# EAGLE design DAU_Kupplung_1_phasig_V1_10 (EAGLE 6.1)
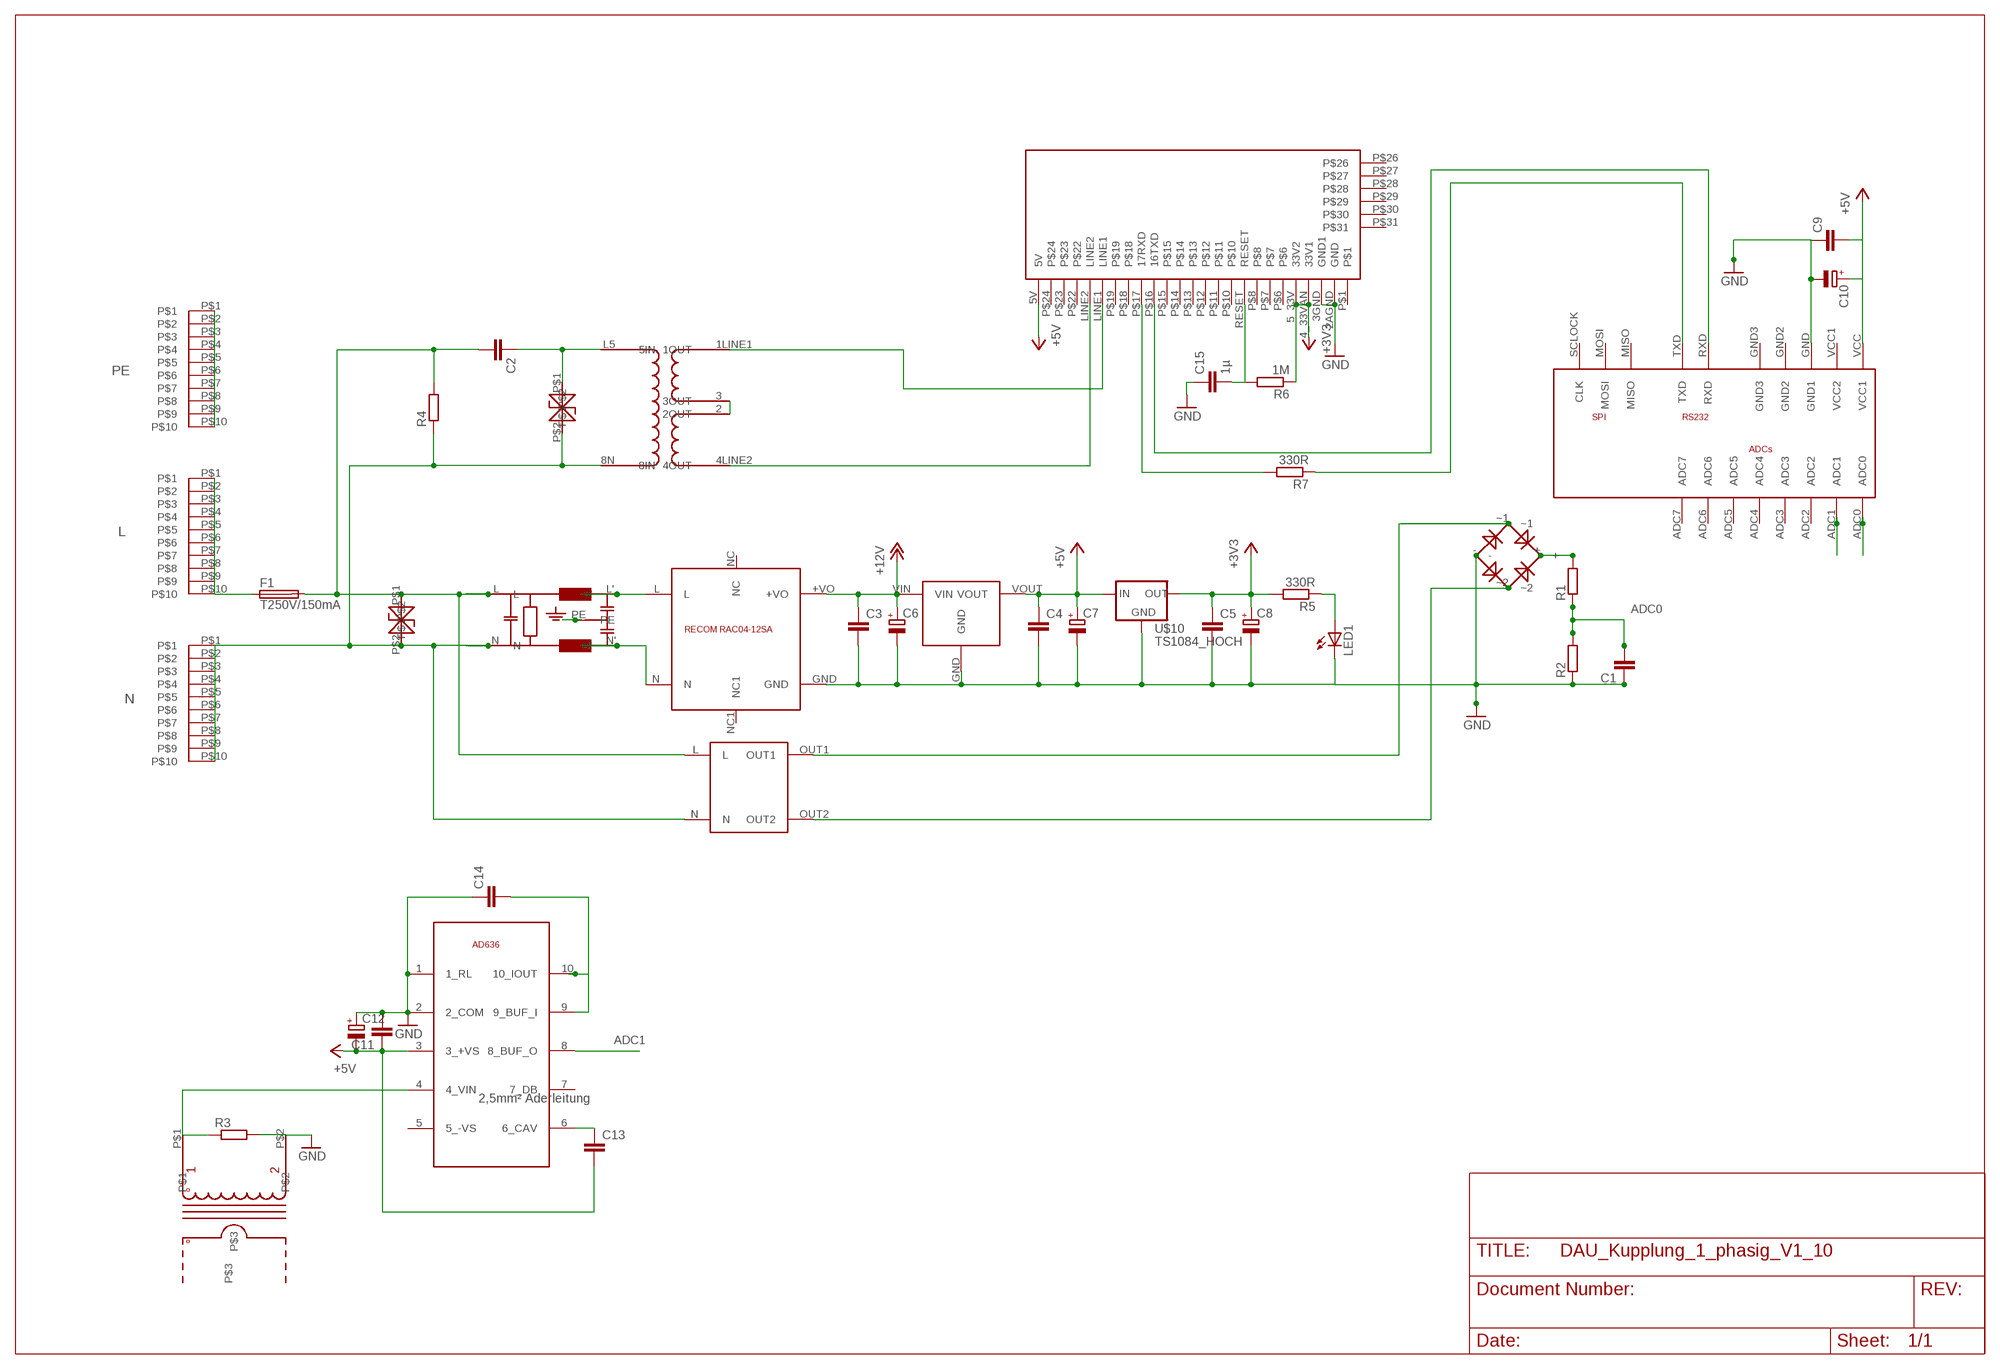
[diagram p0: schematic, sheet 1]

## Parts
C1  C2,5-3  [C2.5-3]
C2  C-EU225-087X268  [C225-087X268]
C3  C-EUC0805  [C0805]
C4  C-EUC0805  [C0805]
C5  C-EUC0805  [C0805]
C6  CPOL-EUE2.5-6  [E2,5-6]
C7  CPOL-EUE2.5-6  [E2,5-6]
C8  CPOL-EUE2.5-6  [E2,5-6]
C9  C-EUC0805  [C0805]
C10  CPOL-EUE2,5-6E  [E2,5-6E]
C11  C-EUC0805  [C0805]
C12  CPOL-EUE2,5-6E  [E2,5-6E]
C13  C-EUC0805  [C0805]
C14  C-EUC0805  [C0805]
C15  1µ  C-EUC0805  [C0805]
F1  T250V/150mA  TR5  [TR5]
L  PRINT_CONNECTOR  [FASTON_DOUBLE]
LED1  LEDSQR2X5  [LED2X5]
N  PRINT_CONNECTOR  [FASTON_DOUBLE]
PE  PRINT_CONNECTOR  [FASTON_DOUBLE]
R1  R-EU_0204/7  [0204/7]
R2  R-EU_0204/7  [0204/7]
R3  R-EU_0204/7  [0204/7]
R4  R-EU_0204/7  [0204/7]
R5  330R  R-EU_0204/7  [0204/7]
R6  1M  R-EU_0204/7  [0204/7]
R7  330R  R-EU_0204/7  [0204/7]
U$1  RECOM_RAC04_12SA  [RAC04_12SA]
U$2  SICHERHEITSTRAFO  [TRAFO_0,35VA]
U$3  ADUC831_MINIMUM  [ADUC_MINIMUM]
U$4  IT800  [IT800]
U$5  PLC_UEBERTRAGER_V2  [PLC-UEBERTRAGER_V2]
U$6  AC1010  [AC1010]
U$7  AD636  [TO100_10PIN]
U$8  RECTIFIER  [RECTIFIER]
U$9  TSV  [TSV]
U$10  TS1084_HOCH  [TS1084_HOCH]
U$11  RECOM_785_05  [RECOM785X]
U$12  TSV  [TSV]
U$13  NETZFILTER_05_A  [NETZFILTER]

## Nets
+3V3: C5.1 C8.+ R5.2 R6.1 U$4.4_33VAN(33V1) U$4.5_33V(33V2) U$10.OUT
+5V: C4.1 C7.+ C9.2 C10.+ C11.1 C12.- C13.2 U$3.VCC(VCC1) U$4.5V U$7.3(3_+VS) U$10.IN U$11.VOUT
+12V: C3.1 C6.+ U$1.+VO U$11.VIN
ADC0: C1.2 R1.1 R2.2 U$3.ADC0
ADC1: U$3.ADC1 U$7.8(8_BUF_O)
GND: C1.1 C3.2 C4.2 C5.2 C6.- C7.- C8.- C9.1 C10.- C11.2 C12.+ C14.1 C15.1 LED1.K(C) R2.1 R3.2 U$1.GND U$3.GND(GND1) U$4.2AGND(GND) U$4.3GND(GND1) U$6.P$2 U$7.1(1_RL) U$7.2(2_COM) U$8.- U$10.GND U$11.GND
N$1: U$5.2(2OUT) U$5.3(3OUT)
N$3: R7.2 U$4.P$17(17RXD)
N$4: U$2.OUT1 U$8.~1
N$5: U$4.LINE1 U$5.1LINE1(1OUT)
N$6: F1.1 L.P$1 L.P$2 L.P$3 L.P$4 L.P$5 L.P$6 L.P$7 L.P$8 L.P$9 L.P$10
N$7: R1.2 U$8.+
N$8: R3.1 U$6.P$1 U$7.4(4_VIN)
N$9: U$2.OUT2 U$8.~2
N$11: C2.1 U$5.L5(5IN) U$12.P$1
N$12: C2.2 F1.2 R4.2 U$2.L U$9.P$1 U$13.L
N$13: U$4.LINE2 U$5.4LINE2(4OUT)
N$14: R7.1 U$3.TXD
N$15: U$3.RXD U$4.P$16(16TXD)
N$16: C14.2 U$7.9(9_BUF_I) U$7.10(10_IOUT)
N$17: C13.1 U$7.6(6_CAV)
N$18: N.P$1 N.P$2 N.P$3 N.P$4 N.P$5 N.P$6 N.P$7 N.P$8 N.P$9 N.P$10 R4.1 U$2.N U$5.8N(8IN) U$9.P$2 U$12.P$2 U$13.N
N$19: LED1.A R5.1
N$20: C15.2 R6.2 U$4.RESET
N$24: U$1.L U$13.L'
N$25: U$1.N U$13.N'
PE: PE.P$1 PE.P$2 PE.P$3 PE.P$4 PE.P$5 PE.P$6 PE.P$7 PE.P$8 PE.P$9 PE.P$10 U$13.PE
Unconnected: U$1.NC U$1.NC1 U$3.ADC2 U$3.ADC3 U$3.ADC4 U$3.ADC5 U$3.ADC6 U$3.ADC7 U$3.GND2 U$3.GND3 U$3.MISO U$3.MOSI U$3.SCLOCK(CLK) U$3.VCC1(VCC2) U$4.P$1 U$4.P$6 U$4.P$7 U$4.P$8 U$4.P$10 U$4.P$11 U$4.P$12 U$4.P$13 U$4.P$14 U$4.P$15 U$4.P$18 U$4.P$19 U$4.P$22 U$4.P$23 U$4.P$24 U$4.P$26 U$4.P$27 U$4.P$28 U$4.P$29 U$4.P$30 U$4.P$31 U$6.P$3 U$7.5(5_-VS) U$7.7(7_DB)

## Notes on the sheet
- PE
- L
- ADC0
- N
- ADC1
- 2,5mm² Aderleitung

## Library data of the parts
C1 = capacitor-wima:C: CAPACITOR naming: grid - package width
C2-C5 C15 = resistor:C-EU: CAPACITOR, European symbol
C6-C8 = resistor:CPOL-EU: POLARIZED CAPACITOR, European symbol
C9 C11 C13 C14 = rcl:C-EU: CAPACITOR, European symbol
C10 C12 = rcl:CPOL-EU: POLARIZED CAPACITOR, European symbol
F1 = fuse:TR5: FUSE Wickmann; OC_FARNELL: unknown; OC_NEWARK: unknown
L N PE = ADS:PRINT_CONNECTOR
LED1 = led:LED: LED OSRAM: - CHIPLED LG R971, LG N971, LY N971, LG Q971, LY Q971, LO R971, LY R971 LH N974, LH R974 LS Q976, LO Q976, LY Q976 LO Q996 - Hyper CHIPLED LW Q18S LB Q993, LB Q99A, LB R99A - SideLED LS A670, LO A670, LY A670, LG A670, LP A670 LB A673, LV A673, LT A673, LW A673 LH A674 LY A675 LS A676, LA A676, LO A676, LY A676, LW A676 LS A679, LY A679, LG A679 - Hyper Micro SIDELED® LS Y876, LA Y876, LO Y876, LY Y876 LT Y87S - SmartLED LW L88C, LW L88S LB L89C, LB L89S, LG L890 LS L89K, LO L89K, LY L89K LS L896, LA L896, LO L896, LY L896 - TOPLED LS T670, LO T670, LY T670, LG T670, LP T670 LSG T670, LSP T670, LSY T670, LOP T670, LYG T670 LG T671, LOG T671, LSG T671 LB T673, LV T673, LT T673, LW T673 LH T674 LS T676, LA T676, LO T676, LY T676, LB T676, LH T676, LSB T676, LW T676 LB T67C, LV T67C, LT T67C, LS T67K, LO T67K, LY T67K, LW E67C LS E67B, LA E67B, LO E67B, LY E67B, LB E67C, LV E67C, LT E67C LW T67C LS T679, LY T679, LG T679 LS T770, LO T770, LY T770, LG T770, LP T770 LB T773, LV T773, LT T773, LW T773 LH T774 LS E675, LA E675, LY E675, LS T675 LS T776, LA T776, LO T776, LY T776, LB T776 LHGB T686 LT T68C, LB T68C - Hyper Mini TOPLED® LB M676 - Mini TOPLED Santana® LG M470 LS M47K, LO M47K, LY M47K Source: http://www.osram.convergy.de LUXEON: - LUMILED® LXK2-PW12-R00, LXK2-PW12-S00, LXK2-PW14-U00, LXK2-PW14-V00 LXK2-PM12-R00, LXK2-PM12-S00, LXK2-PM14-U00 LXK2-PE12-Q00, LXK2-PE12-R00, LXK2-PE12-S00, LXK2-PE14-T00, LXK2-PE14-U00 LXK2-PB12-K00, LXK2-PB12-L00, LXK2-PB12-M00, LXK2-PB14-N00, LXK2-PB14-P00, LXK2-PB14-Q00 LXK2-PR12-L00, LXK2-PR12-M00, LXK2-PR14-Q00, LXK2-PR14-R00 LXK2-PD12-Q00, LXK2-PD12-R00, LXK2-PD12-S00 LXK2-PH12-R00, LXK2-PH12-S00 LXK2-PL12-P00, LXK2-PL12-Q00, LXK2-PL12-R00 Source: www.luxeon.com KINGBRIGHT: KA-3528ASYC Source: www.kingbright.com
R1-R7 = resistor:R-EU_: RESISTOR, European symbol
U$1 = ADS:RECOM_RAC04_12SA
U$2 = ADS:SICHERHEITSTRAFO
U$3 = ADS_ADUCBoards:ADUC831_MINIMUM
U$4 = ADS:IT800
U$5 = ADS1:PLC_UEBERTRAGER_V2
U$6 = ADS:AC1010
U$7 = ADS:AD636
U$8 = ADS:RECTIFIER
U$9 U$12 = ADS:TSV
U$10 = ADS:TS1084_HOCH
U$11 = ADS:RECOM_785_05
U$13 = ADS:NETZFILTER_05_A

## Board
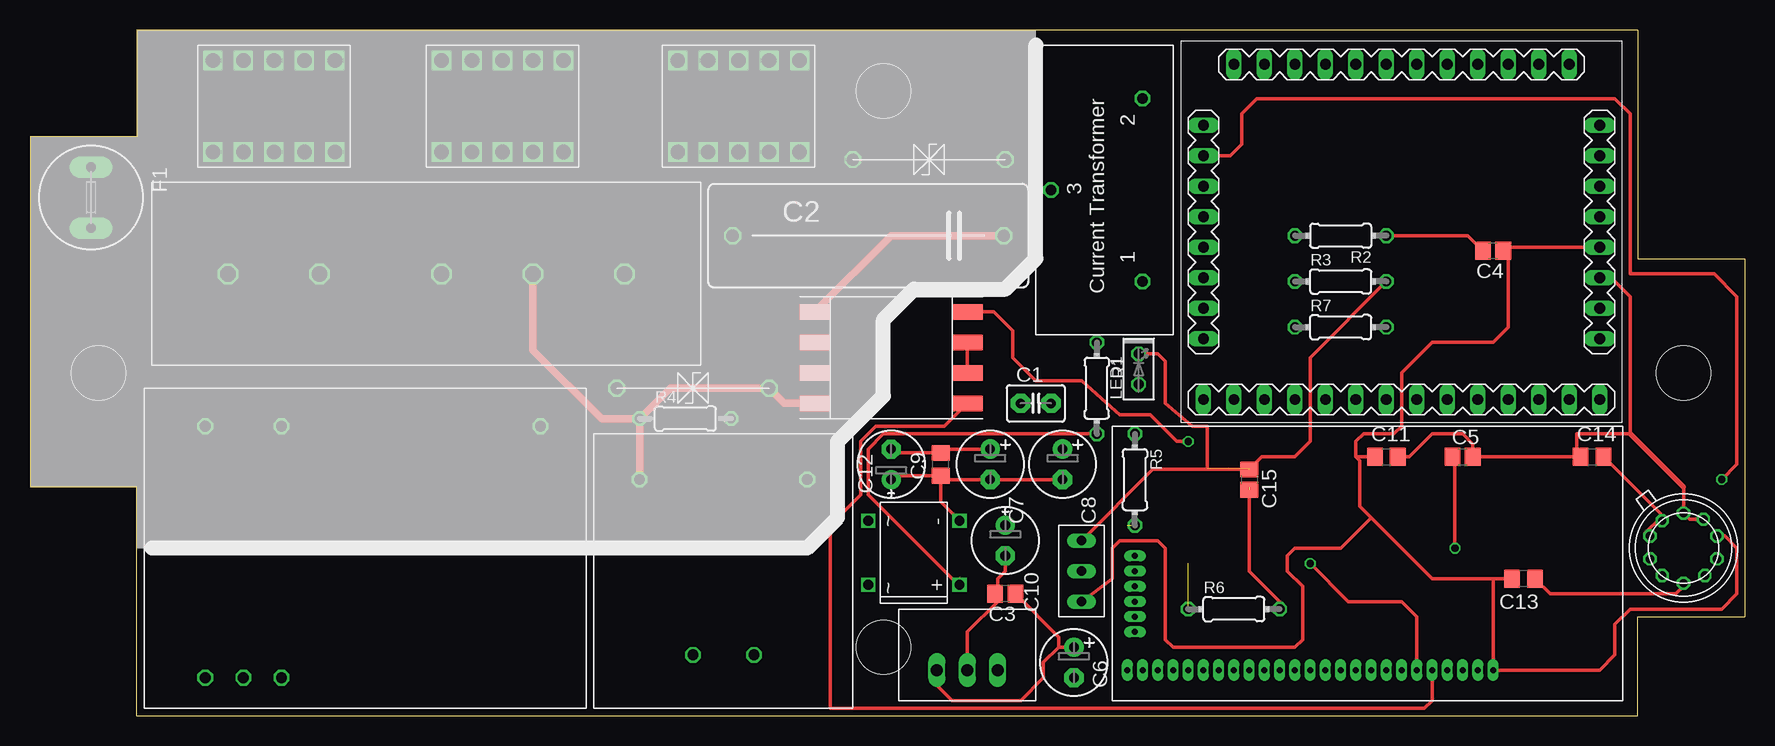
[diagram p1: board, top side]
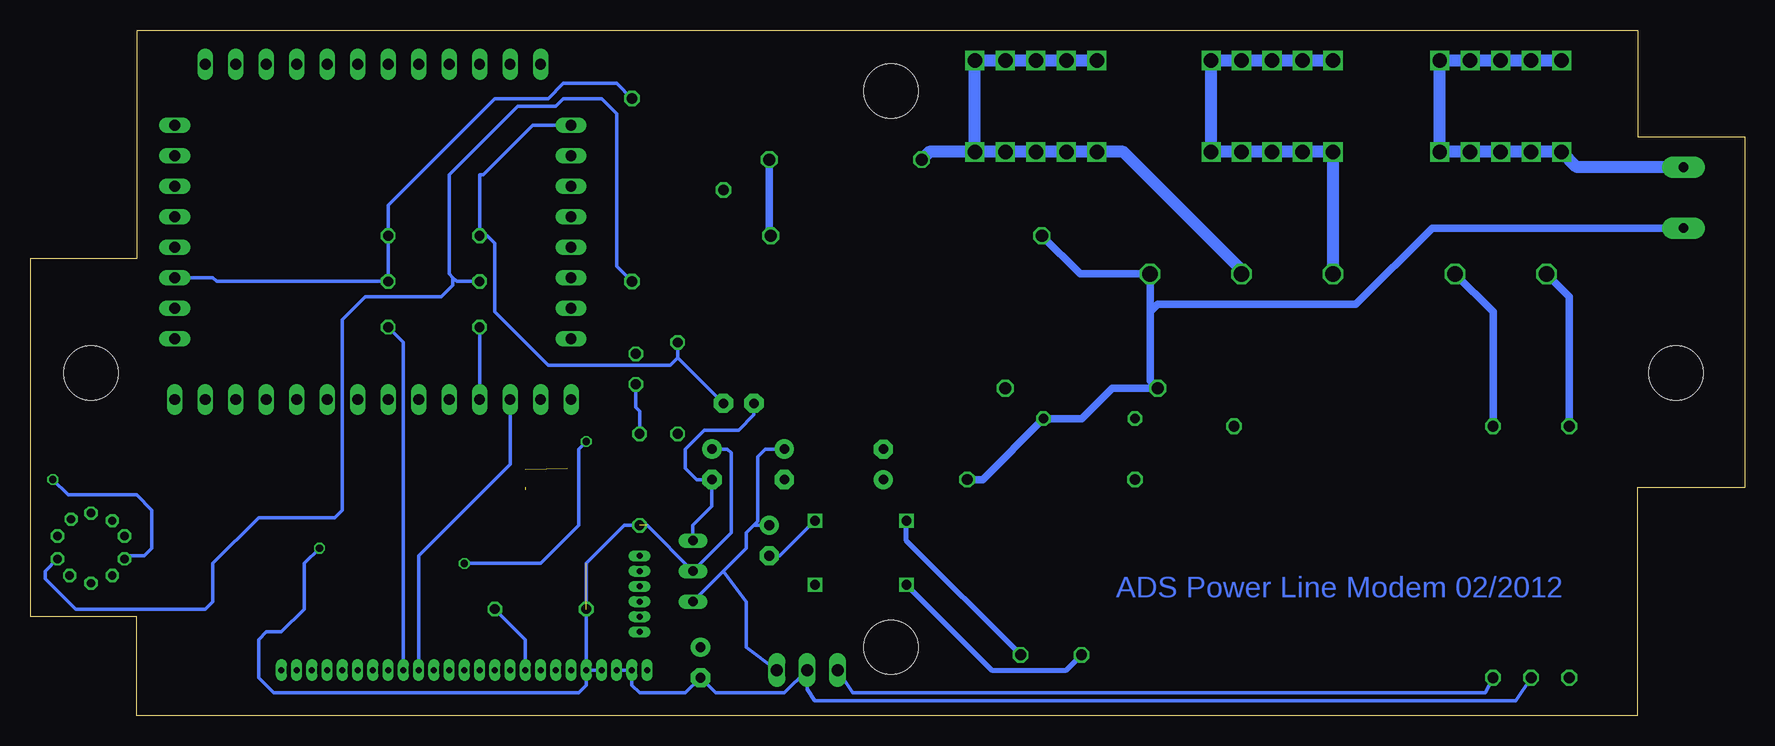
[diagram p2: board, bottom side, seen from below]

Size 142.88 x 57.15 mm. Coordinates in mm from the lower left corner, seen from the top.
Outline: 8.89,0 8.89,19.05 0,19.05 0,48.26 8.89,48.26 8.89,57.15 133.98,57.15 133.98,38.1 142.88,38.1 142.88,8.26 133.98,8.26 133.98,0 8.89,0
Copper layers (1*16): Top 0.035mm / dielectric 1.5mm / Bottom 0.035mm
Design rules: minimum track width 0.15mm, minimum drill 0.3mm, track to track 0.15mm, track to pad 0.15mm, pad to pad 0.15mm, via to via 0.15mm, smd to smd 0.15mm, copper to edge 0.3mm, drill to drill 0.2mm, minimum pad ring 0.2mm, minimum via ring 0.15mm, stop-mask expansion 0.075mm, vias tented up to drill 0mil, thermal gap 0.2mm
Holes 4.5 mm at 71.12,52.07 71.12,5.71 5.71,28.57 137.79,28.57

### Footprints (pad centres in the part's own frame; a part is rotated, then mirrored left to right if it is on the bottom)
C2.5-3 = drill 0.813 pad 1.6 octagon: 1 -1.27,0; 2 1.27,0
C225-087X268 = drill 1.016 octagon: 1 -11.303,0; 2 11.303,0
C0805 = smd 1.3 x 1.5: 1 -0.85,0; 2 0.85,0
E2,5-6 = drill 0.813 pad 1.6: + -1.27,0 | drill 0.813 pad 1.6 octagon: - 1.27,0
C0805' = smd 1.3 x 1.5: 1 -0.95,0; 2 0.95,0
E2,5-6E = drill 0.813 pad 1.575: + -1.27,0 | drill 0.813 pad 1.575 octagon: - 1.27,0
TR5 = drill 0.813 pad 1.778 long: 1 -2.54,0; 2 2.54,0
FASTON_DOUBLE = drill 1.2 square: P$1 -5.08,-3.81; P$2 -2.54,-3.81; P$3 -5.08,3.81; P$4 -2.54,3.81; P$5 0,3.81; P$6 2.54,3.81; P$7 5.08,3.81; P$8 0,-3.81; P$9 2.54,-3.81; P$10 5.08,-3.81
LED2X5 = drill 0.813 octagon: A -1.27,0; K 1.27,0
0204/7 = drill 0.813 octagon: 1 -3.81,0; 2 3.81,0
RAC04_12SA = drill 0.9 octagon: +VO 25.4,24.13; GND 28.575,24.13; L 31.75,3.175; N 25.4,3.175; NC 3.81,3.175; NC1 31.75,24.13
TRAFO_0,35VA = drill 0.9 octagon: L 3.81,17.78; N 3.81,3.81; OUT1 18.415,13.335; OUT2 18.415,8.255
ADUC_MINIMUM = drill 0.9 long: ADC0 -9.207,-16.51; ADC1 -6.668,-16.51; ADC2 -4.128,-16.51; ADC3 -1.587,-16.51; ADC4 6.032,-16.51; ADC5 8.572,-16.51; ADC6 13.652,-16.51; ADC7 13.652,-13.97; ALE -14.287,6.35; DAC0 0.953,-16.51; DAC1 3.493,-16.51; GND 3.493,16.51; GND2 -4.128,16.51; GND3 -6.668,16.51; INT0 13.652,-6.35; MISO 13.652,-3.81; MOSI 13.652,11.43; P00 -14.287,3.81; P01 -14.287,1.27; P02 -14.287,-1.27; P03 -14.287,-3.81; P04 -14.287,-6.35; P05 -14.287,-8.89; P06 -14.287,-11.43; P07 -14.287,-13.97; P20 13.652,13.97; P21 13.652,16.51; P22 8.572,16.51; P23 6.032,16.51; P24 -9.207,16.51; P25 -14.287,13.97; P34 13.652,-1.27; P35 13.652,1.27; P36 13.652,3.81; P37 13.652,6.35; PWM0 -14.287,11.43; PWM1 -14.287,8.89; RXD 13.652,-11.43; SCLOCK 13.652,8.89; TXD 13.652,-8.89; VCC 0.953,16.51; VCC1 -1.587,16.51
IT800 = drill 0.5 long: 2AGND 2.54,2.54; 3GND 3.81,2.54; 4_33VAN 5.08,2.54; 5_33V 6.35,2.54; 5V 31.75,2.54; LINE1 25.4,2.54; LINE2 26.67,2.54; P$1 1.27,2.54; P$6 7.62,2.54; P$7 8.89,2.54; P$8 10.16,2.54; P$10 12.7,2.54; P$11 13.97,2.54; P$12 15.24,2.54; P$13 16.51,2.54; P$14 17.78,2.54; P$15 19.05,2.54; P$16 20.32,2.54; P$17 21.59,2.54; P$18 22.86,2.54; P$19 24.13,2.54; P$22 27.94,2.54; P$23 29.21,2.54; P$24 30.48,2.54; P$26 1.905,5.715; P$27 1.905,6.985; P$28 1.905,8.255; P$29 1.905,9.525; P$30 1.905,10.795; P$31 1.905,12.065; RESET 11.43,2.54
PLC-UEBERTRAGER_V2 = smd 2.54 x 1.27: 1LINE1 6.35,3.81; 2 6.35,1.27; 3 6.35,-1.27; 4LINE2 6.35,-3.81; 6NC -6.35,1.27; 7NC -6.35,-1.27; 8N -6.35,-3.81; L5 -6.35,3.81
AC1010 = drill 0.9 octagon: P$1 20.32,8.89; P$2 5.08,8.89; P$3 12.7,1.27
TO100_10PIN = drill 0.7 octagon: 1 0,-2.921; 2 -1.651,-2.413; 3 -2.794,-1.016; 4 -2.794,0.889; 5 -1.778,2.286; 6 0,2.921; 7 1.778,2.286; 8 2.794,0.889; 9 2.794,-1.016; 10 1.778,-2.286
RECTIFIER = drill 0.8 square: + 6.858,7.62; - 1.524,7.62; ~1 1.524,0; ~2 6.858,0
TSV = drill 1 octagon: P$1 -5.08,0; P$2 7.62,0
TS1084_HOCH = drill 0.8 long: GND 0,0; IN 5.08,0; OUT 2.54,0
RECOM785X = drill 1 long: GND 0,2.54; VIN -2.54,2.54; VOUT 2.54,2.54
NETZFILTER = drill 1.3 octagon: L 6.35,7.62; L' 39.37,7.62; N 13.97,7.62; N' 31.75,7.62; PE 21.59,7.62

### Placement (x,y rotation side)
C1  83.82,26.04 0 top
C2  69.85,40 180 top
C3  81.28,10.16 180 top
C4  121.92,38.73 180 top
C5  119.38,21.59 0 top
C6  87,4.45 270 top
C7  80.01,20.96 270 top
C8  86.04,20.96 270 top
C9  [C0805']  75.88,20.96 90 top
C10  81.28,14.61 270 top
C11  [C0805']  113.03,21.59 0 top
C12  71.76,20.96 90 top
C13  [C0805']  124.46,11.43 180 top
C14  [C0805']  130.17,21.59 0 top
C15  101.6,19.68 270 top
F1  5.08,43.18 270 top
L  20.32,50.8 0 top
LED1  92.39,28.89 90 top
N  59.05,50.8 180 top
PE  39.37,50.8 180 top
R1  88.9,27.3 270 top
R2  109.22,40 180 top
R3  109.22,36.2 0 top
R4  54.61,24.77 0 top
R5  92.08,19.68 270 top
R6  100.33,8.89 0 top
R7  109.22,32.38 0 top
U$1  46.35,27.3 180 top
U$2  46.99,23.5 270 top
U$3  114.3,40 270 top
U$4  90.17,1.27 0 top
U$5  71.76,29.84 0 top
U$6  83.82,56.51 270 top
U$7  137.79,13.97 180 top
U$8  69.85,17.78 270 top
U$9  53.97,27.3 0 top
U$10  87.63,14.61 270 top
U$11  78.11,1.27 0 top
U$12  76.2,46.35 180 top
U$13  55.88,44.45 180 top

### Tracks (layer width: path | path; a pad name or v marks a point on that pad's centre or on a via)
+3V3  (via drill 0.6)  (2 unrouted)
  Top 0.305: C5.1 118.75,21.38 v118.75,13.97
  Bottom 0.305: U$4.5_33V U$4.4_33VAN | U$4.5_33V 96.52,12.7 93.34,15.88 91.44,15.88 U$10.OUT 84.45,15.24 84.45,21.91 84.77,22.23 C8.+ | v118.75,13.97 120.02,12.7 120.02,8.89 121.92,6.99 123.19,6.99 123.83,6.35 123.83,3.18 122.56,1.9 97.16,1.9 96.52,2.54 U$4.5_33V
+5V
  Top 0.305: C12.- 72.08,21.91 C9.2 76.2,22.23 C7.+ | U$4.5V 122.14,3.6 | U$4.5V 121.92,11.43 | U$7.3 141.22,14.99 142.24,13.97 142.24,10.16 140.97,8.89 133.35,8.89 132.08,7.62 132.08,5.08 130.81,3.81 U$4.5V | C4.1 123.19,38.73 | 121.92,11.43 C13.2 | U$10.IN 90.17,11.43 90.17,13.97 90.81,14.61 93.98,14.61 94.62,13.97 94.62,6.35 95.25,5.71 105.41,5.71 106.05,6.35 106.05,10.79 104.78,12.07 104.78,13.34 105.41,13.97 109.22,13.97 111.76,16.51 | 121.92,11.43 116.84,11.43 111.76,16.51 | 111.76,16.51 110.81,17.46 110.81,21.28 110.49,21.59 | 110.49,21.59 110.49,22.86 111.12,23.5 113.67,23.5 114.3,24.13 114.3,28.57 116.84,31.11 121.92,31.11 123.19,32.38 123.19,38.73 | C11.1 110.49,21.59 | 123.19,38.73 123.19,39.05 U$3.VCC
  Bottom 0.305: 85.09,12.07 83.19,9.53 83.19,5.71 U$11.VOUT | U$10.IN 85.09,12.07 | 85.09,12.07 83.19,13.97 83.19,15.24 82.55,15.88 | C10.+ 82.55,15.88 | 82.55,15.88 82.23,16.19 82.23,21.59 81.6,22.23 C7.+
+12V
  Top 0.305: 85.73,5.71 84.45,4.45 84.45,3.18 82.55,1.27 76.84,1.27 75.56,2.54 U$11.VIN | 85.73,5.71 C6.+ | C3.1 85.73,6.56 85.73,5.71
  Bottom 0.305: U$1.+VO 21.59,1.9 74.3,1.9 U$11.VIN
ADC0
  Bottom 0.305: C1.2 88.9,29.84 | R1.1 88.9,29.84 | 88.9,29.84 89.54,29.21 99.7,29.21 104.14,33.65 104.14,39.37 104.78,40 R2.2 105.41,45.08 105.09,45.08 100.97,49.21 U$3.ADC0
ADC1  (via drill 0.6)
  Top 0.305: v140.97,19.68 142.24,20.96 142.24,34.92 140.33,36.83 133.35,36.83 133.35,50.16 132.08,51.43 102.23,51.43 100.97,50.16 100.97,47.62 100.01,46.67 U$3.ADC1
  Bottom 0.305: U$7.8 134.75,13.34 133.35,13.34 132.72,13.97 132.72,17.14 133.98,18.41 139.7,18.41 v140.97,19.68
GND  (1 unrouted)
  Top 0.305: 137.79,19.05 U$7.1 138.3,16.38 U$7.2 | C12.+ 72.08,20 C9.1 | 87,14.61 U$10.GND 93.56,20.54 C15.1 102.66,21.59 105.41,21.59 106.68,22.86 106.68,29.84 R3.2 | C5.2 120.02,21.59 | C4.2 119.8,40 R2.1 | C5.2 C14.1 | C14.1 129.54,21.59 | C14.1 128.91,21.91 128.91,23.5 133.35,23.5 133.35,34.92 131.76,36.51 U$3.GND | C11.2 114.94,21.59 116.84,23.5 119.38,23.5 120.23,22.64 C5.2 | 80.65,9.95 80.65,11.43 81.28,12.07 C10.- | 80.65,9.95 80.65,9.53 78.11,6.99 U$11.GND | 80.65,9.95 C3.2 | LED1.K 93.98,30.16 94.62,29.53 94.62,26.04 96.84,24.13 98.11,24.13 98.11,20.64 | C9.1 76.2,19.68 C7.- C8.- | U$8.- 75.88,17.84 C9.1
  Top 0.406: 137.79,19.05 133.35,23.5
  Bottom 0.305: U$6.P$2 93.98,52.7 98.42,52.7 99.7,51.43 104.14,51.43 113.03,42.54 R2.1 R3.2 127.32,36.2 127.64,36.51 U$3.GND | U$1.GND 19.05,1.27 77.47,1.27 78.11,2.22 U$11.GND 80.01,1.9 85.73,1.9 C6.- 88.27,1.9 92.08,1.9 92.71,2.54 U$4.2AGND U$4.3GND | U$8.- 80.39,13.34 C10.- | C1.1 82.55,25.08 83.82,23.81 86.68,23.81 88.27,22.23 88.27,20.64 87.31,19.68 C8.- 86.04,17.46 87.63,15.88 U$10.GND
N$1
  Top 0.305: U$5.3 U$5.2
N$3
  Bottom 0.305: R7.2 111.76,31.11 U$4.P$17
N$4
  Bottom 0.406: U$2.OUT1 69.85,14.61 U$8.~1
N$5  (via drill 0.6)
  Top 0.305: v106.68,12.7 109.86,9.53 114.3,9.53 115.57,8.26 U$4.LINE1 | U$5.1LINE1 80.33,33.65 81.92,32.07 81.92,29.84 83.82,27.94 87.63,27.94 90.49,25.4 90.81,25.08 93.34,25.08 95.57,22.86 v96.52,22.86
  Bottom 0.305: v96.52,22.86 97.16,22.23 97.16,15.88 100.33,12.7 v106.68,12.7
N$6
  Bottom 1.016: F1.1 13.97,45.72 L.P$1 L.P$2 L.P$8 L.P$9 L.P$10 L.P$7 L.P$6 L.P$5 L.P$4 L.P$3
N$7
  Top 0.305: 77.47,11.43 U$8.+ 77.34,10.92 69.85,18.41 69.85,22.23 71.12,23.5 R1.2
N$8
  Bottom 0.305: U$6.P$1 93.98,37.46 93.98,50.16 95.25,51.43 98.42,51.43 99.06,50.8 102.23,50.8 107.95,45.08 107.95,36.83 107.63,36.51 | 107.63,36.51 107.31,36.2 R3.1 | U$7.4 141.6,12.07 141.6,11.43 139.06,8.89 128.27,8.89 127.64,9.53 127.64,12.7 123.83,16.51 117.48,16.51 116.84,17.14 116.84,33.02 114.94,34.92 108.59,34.92 107.63,35.88 107.63,36.51
N$9
  Bottom 0.406: U$8.~2 62.74,3.81 56.51,3.81 U$2.OUT2
N$11
  Top 0.61: C2.1 71.76,40 U$5.L5
  Bottom 0.61: U$12.P$1 81.28,40.13 C2.1
N$12
  Bottom 0.61: 49.53,33.65 U$13.L 55.37,36.83 C2.2 | 49.53,33.65 49.53,27.94 U$9.P$1 52.7,27.3 55.24,24.77 R4.2 63.5,19.68 U$2.L | F1.2 26.04,40.64 32.38,34.29 48.89,34.29 49.53,33.65
N$13
  Top 0.305: U$5.4LINE2 76.2,24.13 70.48,24.13 69.22,22.86 69.22,18.41 66.67,15.88 66.67,0.64 116.2,0.64 116.84,1.27 U$4.LINE2
N$14
  Bottom 0.305: R7.1 U$3.TXD
N$15
  Bottom 0.305: U$4.P$16 110.49,13.34 102.87,20.96 U$3.RXD
N$16
  Top 0.305: C14.2 135.89,16.82 135.89,16.51 | 135.89,16.51 134.62,15.24 134.75,15.24 U$7.9 | 135.89,16.51 135.89,16.38 U$7.10
N$17
  Top 0.305: C13.1 126.68,10.16 137.16,10.16 137.79,10.79 U$7.6
N$18
  Top 0.61: U$13.N 41.91,30.48 47.62,24.77 R4.1 | R4.1 U$2.N | R4.1 53.34,27.3 U$9.P$2 62.87,26.04 U$5.8N
  Bottom 1.016: U$13.N 41.91,37.15 51.75,46.99 N.P$7 N.P$6 N.P$5 N.P$4 N.P$3 | N.P$3 67.95,46.99 U$12.P$2 | N.P$3 N.P$1 N.P$2 N.P$8 N.P$9 N.P$10
N$19
  Bottom 0.305: R5.1 92.08,25.4 92.39,25.72 LED1.A
N$20  (1 unrouted)
  Top 0.305: 101.6,19.05 101.6,12.07 104.14,9.53 R6.2
  Bottom 0.305: U$4.RESET 101.6,6.35 R6.2
N$24
  Bottom 0.61: U$1.L 14.61,34.92 U$13.L'
N$25
  Bottom 0.61: U$1.N 20.96,33.65 U$13.N'
PE
  Bottom 1.016: U$13.PE PE.P$7 PE.P$6 | 37.15,46.67 PE.P$6 | PE.P$6 PE.P$5 PE.P$4 PE.P$3 PE.P$1 PE.P$2 PE.P$8 PE.P$9 PE.P$10

### Text on the board
Bottom: ADS Power Line Modem 02/2012